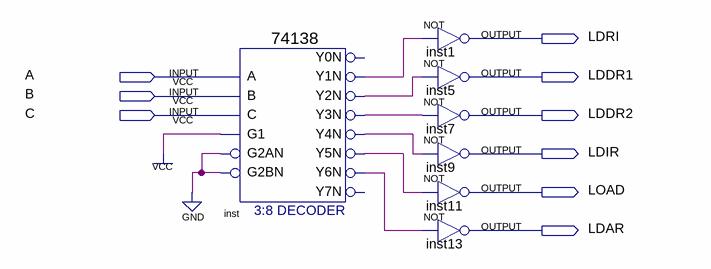
[diagram p0: schematic sheet]
// Quartus schematic decoder_A.bdf as structural Verilog: 7 symbols, 9 pins
module decoder_A (
  input  A,
  input  B,
  input  C,
  output LDRI,
  output LDDR1,
  output LDDR2,
  output LDIR,
  output LOAD,
  output LDAR
);

  wire inst_y1n, inst_y2n, inst_y3n, inst_y4n, inst_y5n, inst_y6n;

  \74138  inst (
    .A(A), .B(B), .G1(1'b1), .C(C), .G2AN(1'b0), .G2BN(1'b0), .Y1N(inst_y1n), .Y2N(inst_y2n), .Y3N(inst_y3n),
    .Y4N(inst_y4n), .Y5N(inst_y5n), .Y6N(inst_y6n));  // open: Y0N, Y7N
  not inst1 (LDRI, inst_y1n);
  not inst5 (LDDR1, inst_y2n);
  not inst7 (LDDR2, inst_y3n);
  not inst9 (LDIR, inst_y4n);
  not inst11 (LOAD, inst_y5n);
  not inst13 (LDAR, inst_y6n);
endmodule
